# Altium schematic sheet 3V3-CAN-UNISOLATED.SchDoc
size A4; Organization: UNSW Solar Racing Team; Address3: UNSW; Address4: Sydney NSW 2052; Address2: Electrical Engineering; Address1: Rm 109
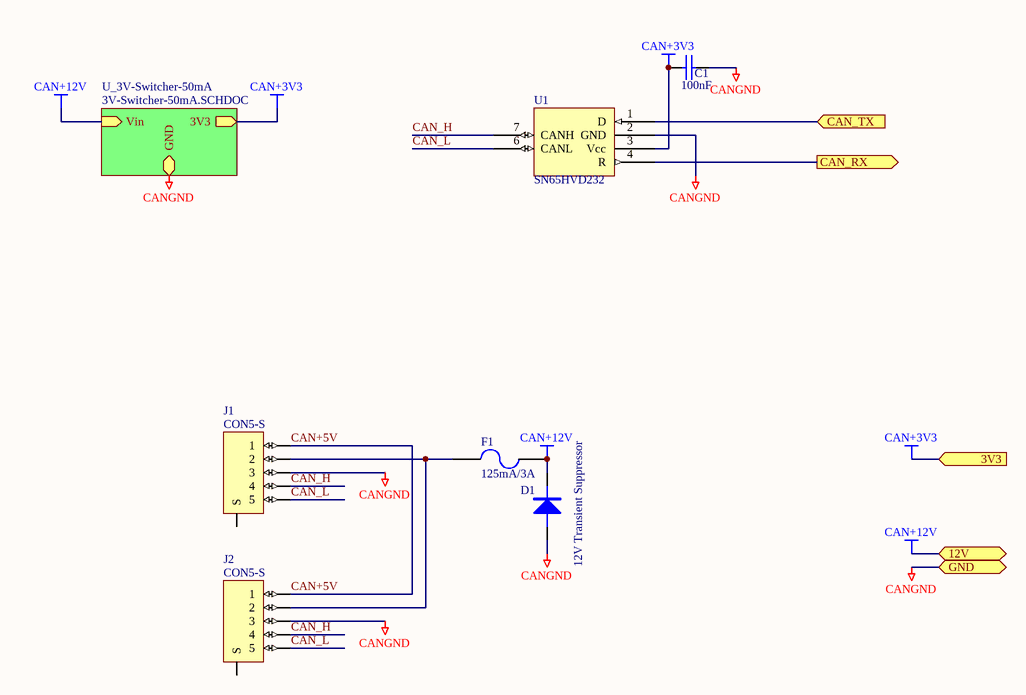
[diagram p0: 3V3-CAN-UNISOLATED.SchDoc]

## Parts
C1  100nF  [0603]
D1  12V Transient Suppressor  [SMA]
F1  125mA/3A  [LITTELFUSE-154]
J1  CON5-S  [TRIAD5F]
J2  CON5-S  [TRIAD5F]
U1  SN65HVD232  [SO8]

## Sub-sheets
U_3V-Switcher-50mA = 3V-Switcher-50mA.SCHDOC: GND, 3V3, Vin

## Ports
3V3, 12V, CAN_RX (out), CAN_TX (in), GND

## Nets
CAN+3V3: C1.2 U1.3(Vcc) ; port 3V3, sheet U_3V-Switcher-50mA/3V3
CAN+12V: D1.K F1.2 ; port 12V, sheet U_3V-Switcher-50mA/Vin
CANGND: C1.1 D1.A J1.3 J2.3 U1.2(GND) ; port GND, sheet U_3V-Switcher-50mA/GND
CAN+5V: J1.1 J2.1
CAN_H: J1.4 J2.4 U1.7(CANH)
CAN_L: J1.5 J2.5 U1.6(CANL)
CAN_RX: U1.4(R) ; port CAN_RX
CAN_TX: U1.1(D) ; port CAN_TX
NetF1_1: F1.1 J1.2 J2.2

Not connected (* = marked no-connect by the designer): J1 0(S); J2 0(S)

## Notes on the sheet
- Title
- Size:
- Date:
- A4
- Number:
- Time:
- Revision:
- Sheet
- of
- File:

## Library data of the parts
C1 = CAP: Capacitor; Needed?: NO - HW LAB; Value: 100nF
D1 = DIODE: Needed?: NO - Workshop; Farnell: 302-3096; Farnell Price: 1.25
F1 = FUSE2: Fuse; Needed?: NO - Workshop; Farnell: 664-893; Other Info: www.littelfuse.com; Farnell Price: 5.67
J1 J2 = CON5-S: Connector, 2 pin, with shield @ S; Needed?: NO - Workshop; Farnell Price: 19.32
U1 = SN65HVD232: 3.3V CAN Transciever; Needed?: Unsure - RS; RS: 461-9771; RS Price: 3.81; Farnell: 1103107; Farnell Price: 5.10